# EAGLE design apo_board_2014 (EAGLE 6.5.0)
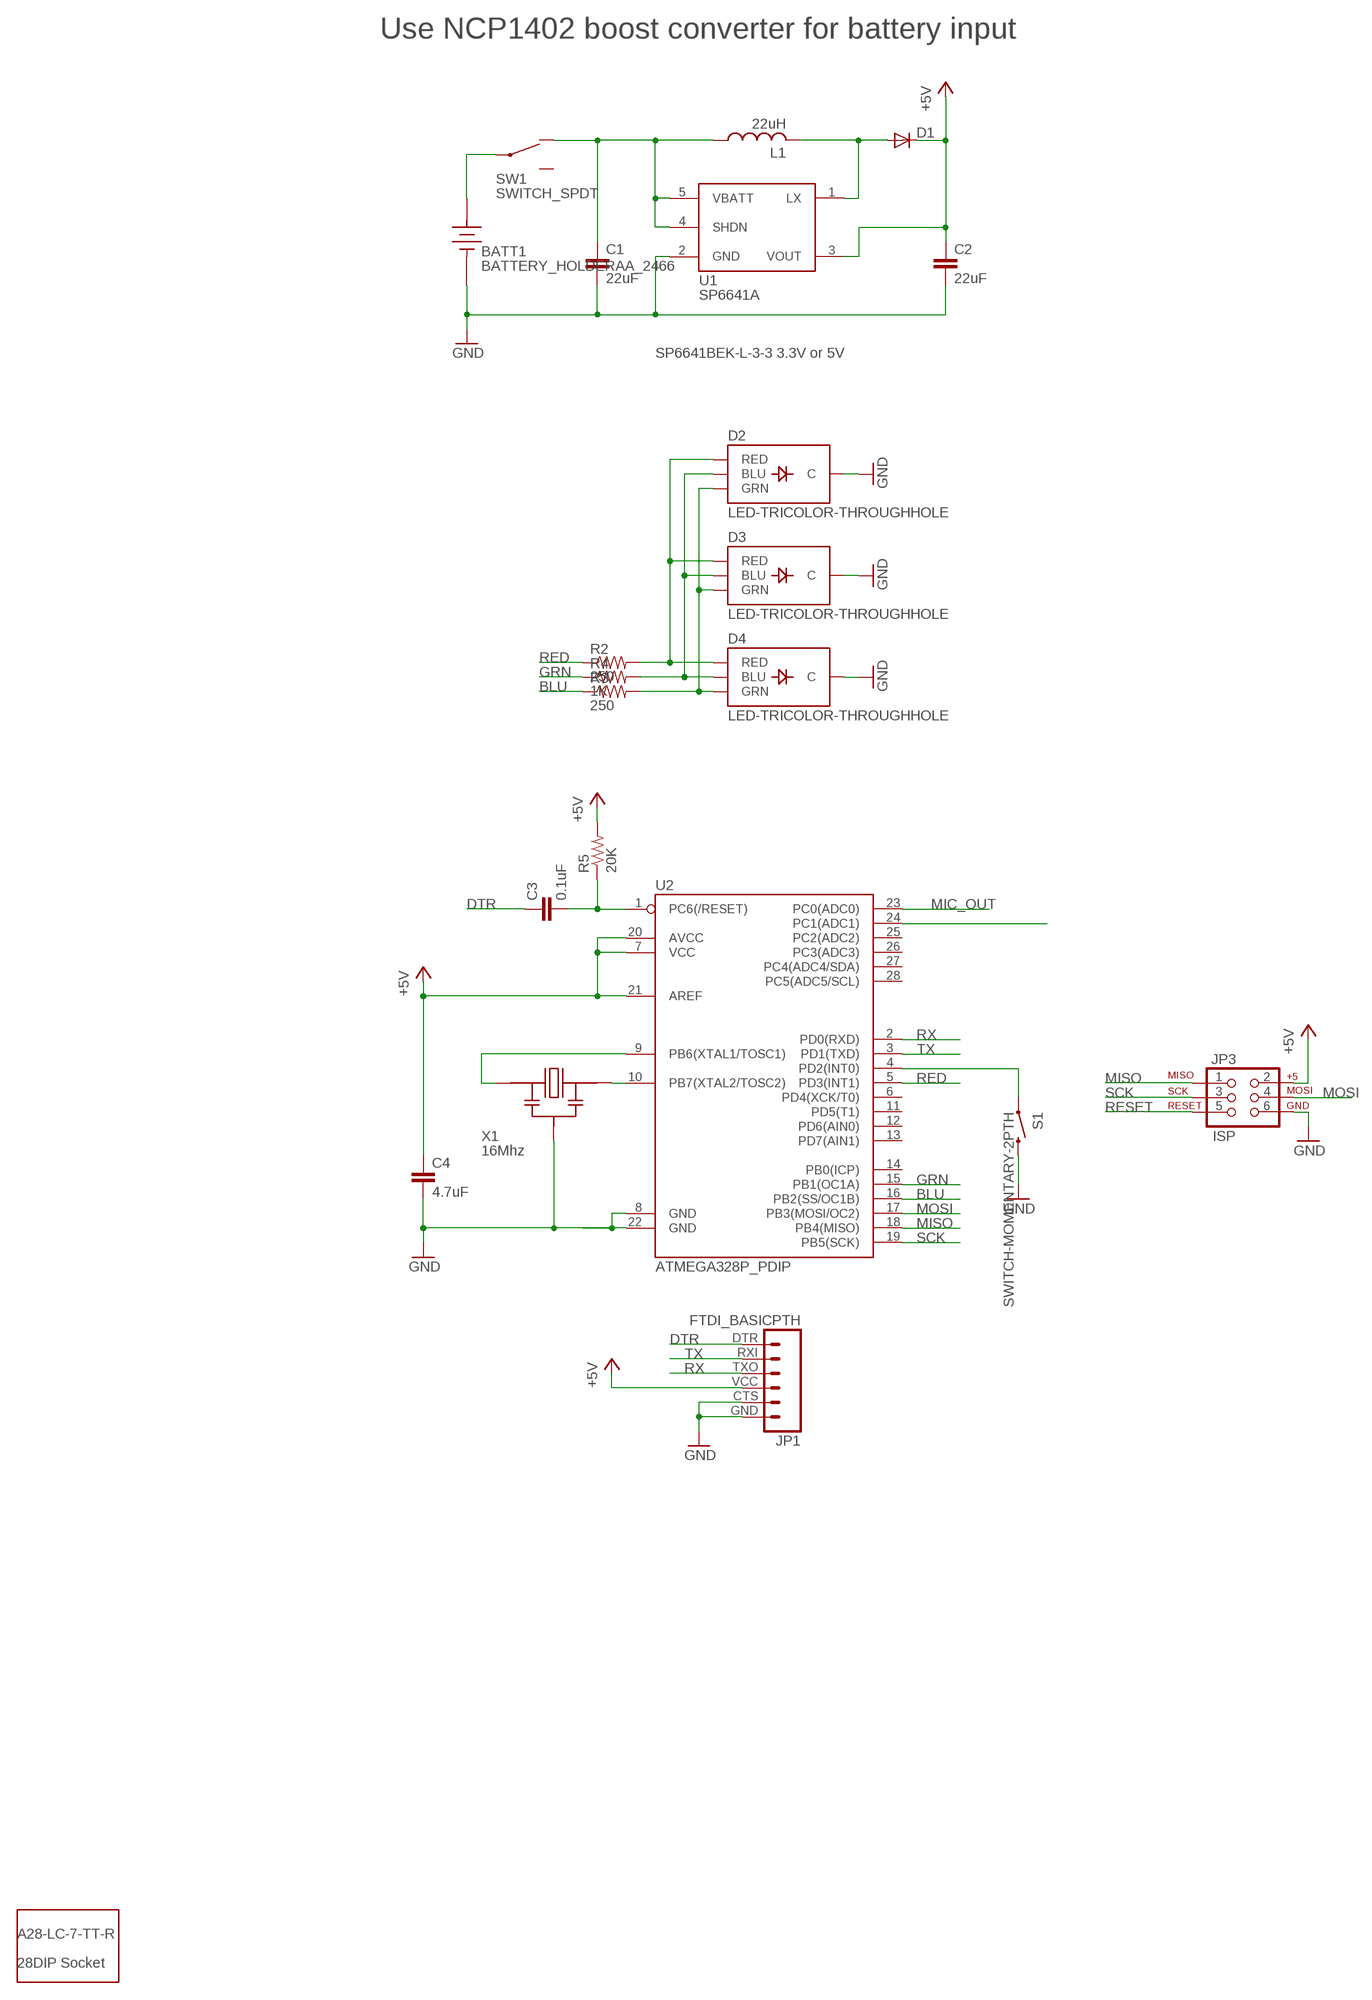
[diagram p0: schematic, sheet 1]

## Parts
BATT1  BATTERY_HOLDERAA_2466  [BATT_HOLDER_AA_2466]
C1  22uF  CAPKIT  [CAP-PTH-SMALL-KIT]
C2  22uF  CAPKIT  [CAP-PTH-SMALL-KIT]
C3  0.1uF  CAPKIT  [CAP-PTH-SMALL-KIT]
C4  4.7uF  CAPKIT  [CAP-PTH-SMALL-KIT]
D1  DIODEKIT  [DIODE-1N4148-KIT]
D2  LED-TRICOLOR-THROUGHHOLE  [LED-TRICOLOR-THROUGHHOLE]
D3  LED-TRICOLOR-THROUGHHOLE  [LED-TRICOLOR-THROUGHHOLE]
D4  LED-TRICOLOR-THROUGHHOLE  [LED-TRICOLOR-THROUGHHOLE]
JP1  FTDI_BASICPTH  [FTDI_BASIC]
JP3  ISP  AVR_SPI_PRG_6PTH  [2X3]
L1  22uH  INDUCTORAIUR-02H  [INDUCTOR_AIUR-02H]
R2  250  RESISTORKIT  [AXIAL-0.3-KIT]
R3  250  RESISTORKIT  [AXIAL-0.3-KIT]
R4  1K  RESISTORKIT  [AXIAL-0.3-KIT]
R5  20K  RESISTORKIT  [AXIAL-0.3-KIT]
S1  SWITCH-MOMENTARY-2PTH  [TACTILE-PTH]
SW1  SWITCH_SPDT  [SWITCH_SPDT_OS102011MA1QN1C]
U1  SP6641A  [SOT23-5]
U2  ATMEGA328P_PDIP  [DIL28-3]
X1  16Mhz  CERAMIC_RESONATOR  [CERAMIC_RESONATOR_ZTT]

## Nets
+5V: C2.1 C4.1 D1.C JP1.VCC JP3.2 R5.P$2 U1.3(VOUT) U2.7(VCC) U2.20(AVCC) U2.21(AREF)
BATT: BATT1.P SW1.P$2(COMMON)
BLU: R3.P$1 U2.16(PB2(SS/OC1B))
DTR: C3.1 JP1.DTR
GND: BATT1.N C1.2 C2.2 C4.2 D2.GND(C) D3.GND(C) D4.GND(C) JP1.CTS JP1.GND JP3.6 S1.3 U1.2(GND) U2.8(GND) U2.22(GND) X1.P$2
GRN: R4.P$1 U2.15(PB1(OC1A))
MIC_OUT: U2.23(PC0(ADC0))
MISO: JP3.1 U2.18(PB4(MISO))
MOSI: JP3.4 U2.17(PB3(MOSI/OC2))
N$1: U2.9(PB6(XTAL1/TOSC1)) X1.P$1
N$2: U2.10(PB7(XTAL2/TOSC2)) X1.P$3
N$3: S1.1 U2.4(PD2(INT0))
N$8: D2.GRN D3.GRN D4.GRN R3.P$2
N$9: D2.BLU D3.BLU D4.BLU R4.P$2
N$10: C3.2 R5.P$1 U2.1(PC6(/RESET))
N$12: U2.24(PC1(ADC1))
N$13: D2.RED D3.RED D4.RED R2.P$2
N$14: D1.A L1.P$2 U1.1(LX)
N$16: C1.1 L1.P$1 SW1.P$3 U1.4(SHDN) U1.5(VBATT)
RED: R2.P$1 U2.5(PD3(INT1))
RESET: JP3.5
RX: JP1.TXO U2.2(PD0(RXD))
SCK: JP3.3 U2.19(PB5(SCK))
TX: JP1.RXI U2.3(PD1(TXD))
Unconnected: SW1.P$1 U2.6(PD4(XCK/T0)) U2.11(PD5(T1)) U2.12(PD6(AIN0)) U2.13(PD7(AIN1)) U2.14(PB0(ICP)) U2.25(PC2(ADC2)) U2.26(PC3(ADC3)) U2.27(PC4(ADC4/SDA)) U2.28(PC5(ADC5/SCL))

## Notes on the sheet
- Use NCP1402 boost converter for battery input
- SP6641BEK-L-3-3 3.3V or 5V

## Library data of the parts
BATT1 = 1_BES_ELECTROMECHANICAL:BATTERY_HOLDER
C1-C4 = SparkFun-Passives:CAP: Capacitor Standard 0603 ceramic capacitor, and 0.1" leaded capacitor.
D1 = SparkFun-DiscreteSemi:DIODE: Diode These are standard reverse protection diodes and small signal diodes. SMA package can handle up to about 1A. SOD-323 can handle about 200mA. What the SOD-323 package when ordering, there are some mfgs out there that are 5-pin packages.
D2-D4 = SparkFun:LED-TRICOLOR-THROUGHHOLE
JP1 = SparkFun-Connectors:FTDI_BASIC: FTDI Basic header with labels
JP3 = SparkFun:AVR_SPI_PRG_6: AVR ISP 6 Pin This is the reduced ISP connector for AVR programming. Common on Arduino. This footprint will take up less PCB space and can be used with a 10-pin to 6-pin adapter such as SKU: BOB-08508
L1 = 1_Dan Master:INDUCTOR: SMT Inductor
R2-R5 = SparkFun-Passives:RESISTOR: Resistor Basic schematic elements and footprints for 0603, 1206, and PTH resistors.
S1 = SparkFun:SWITCH-MOMENTARY-2
SW1 = 1_Dan Master:SWITCH_SPDT
U1 = 1_Dan Master:SP6641A
U2 = SparkFun-DigitalIC:ATMEGA328P_PDIP: uC used in the Arduino 32kb flash, 1k EEPROM, 2k SRAM This is the through-hole version of this chip.
X1 = 1_Dan Master:CERAMIC_RESONATOR

## Net classes
0 default: width 0.203 mm
1 vcc: width 0.254 mm

## Board
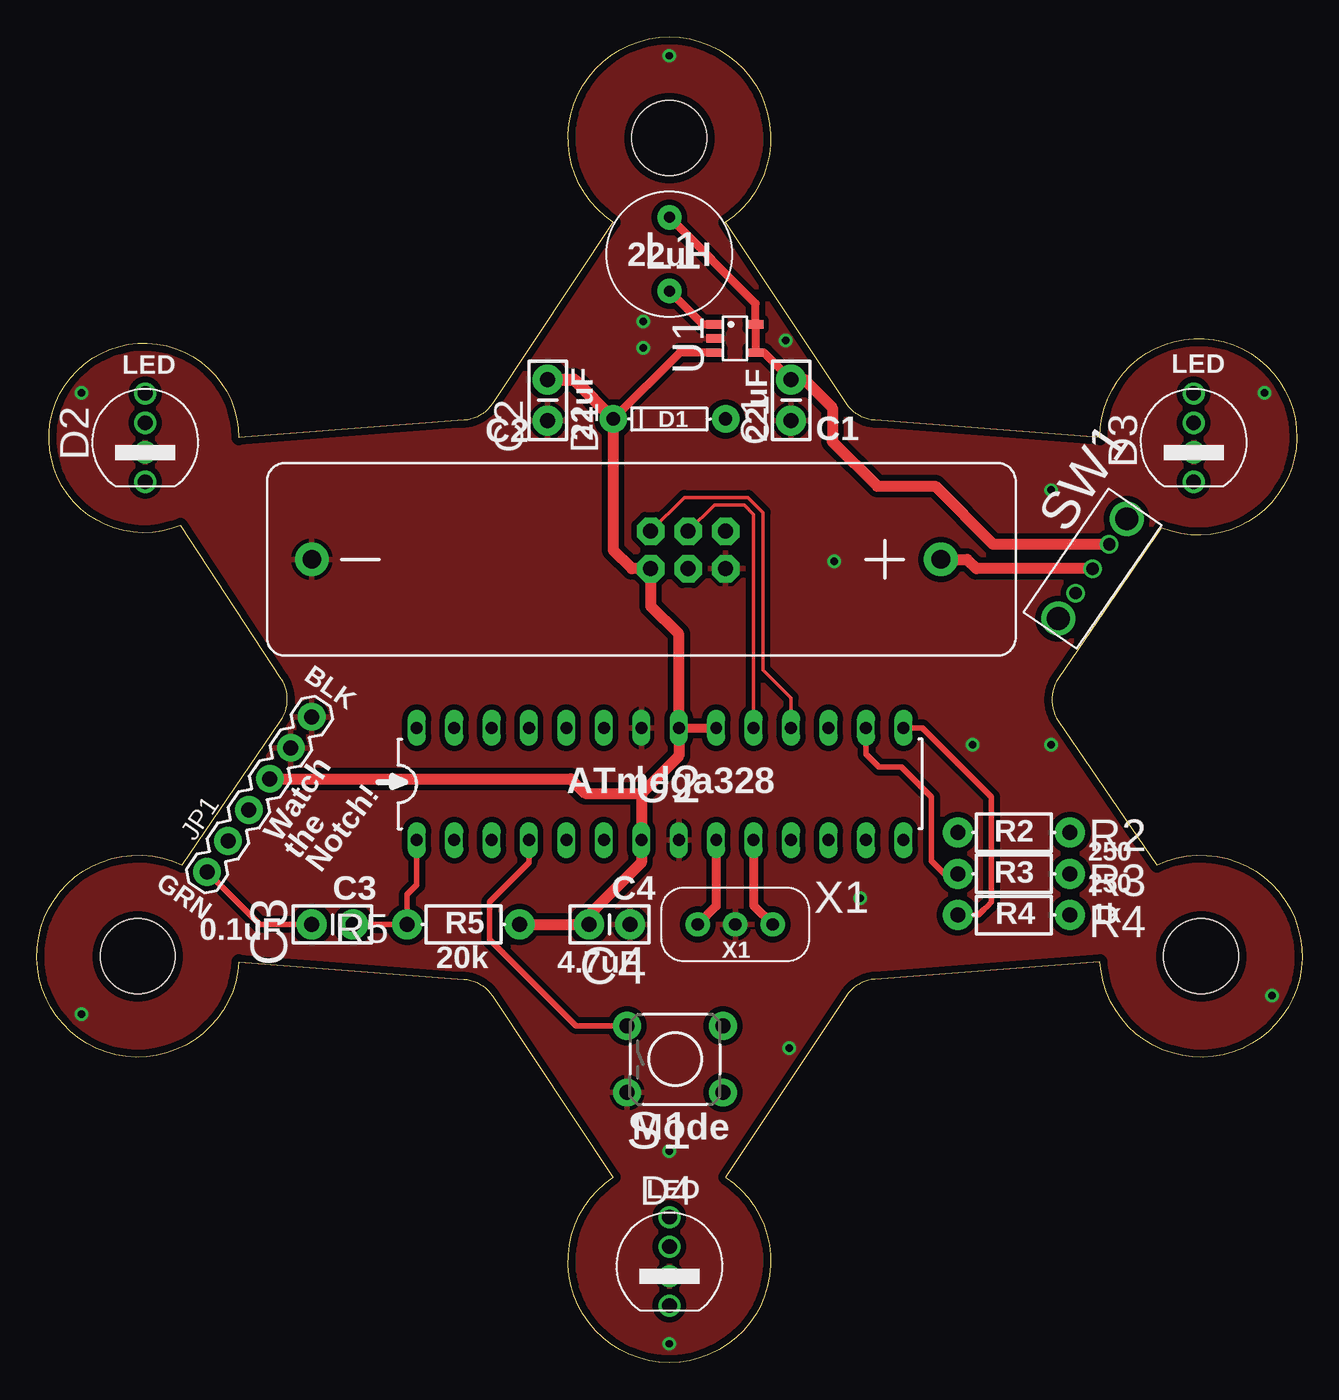
[diagram p1: board, top side]
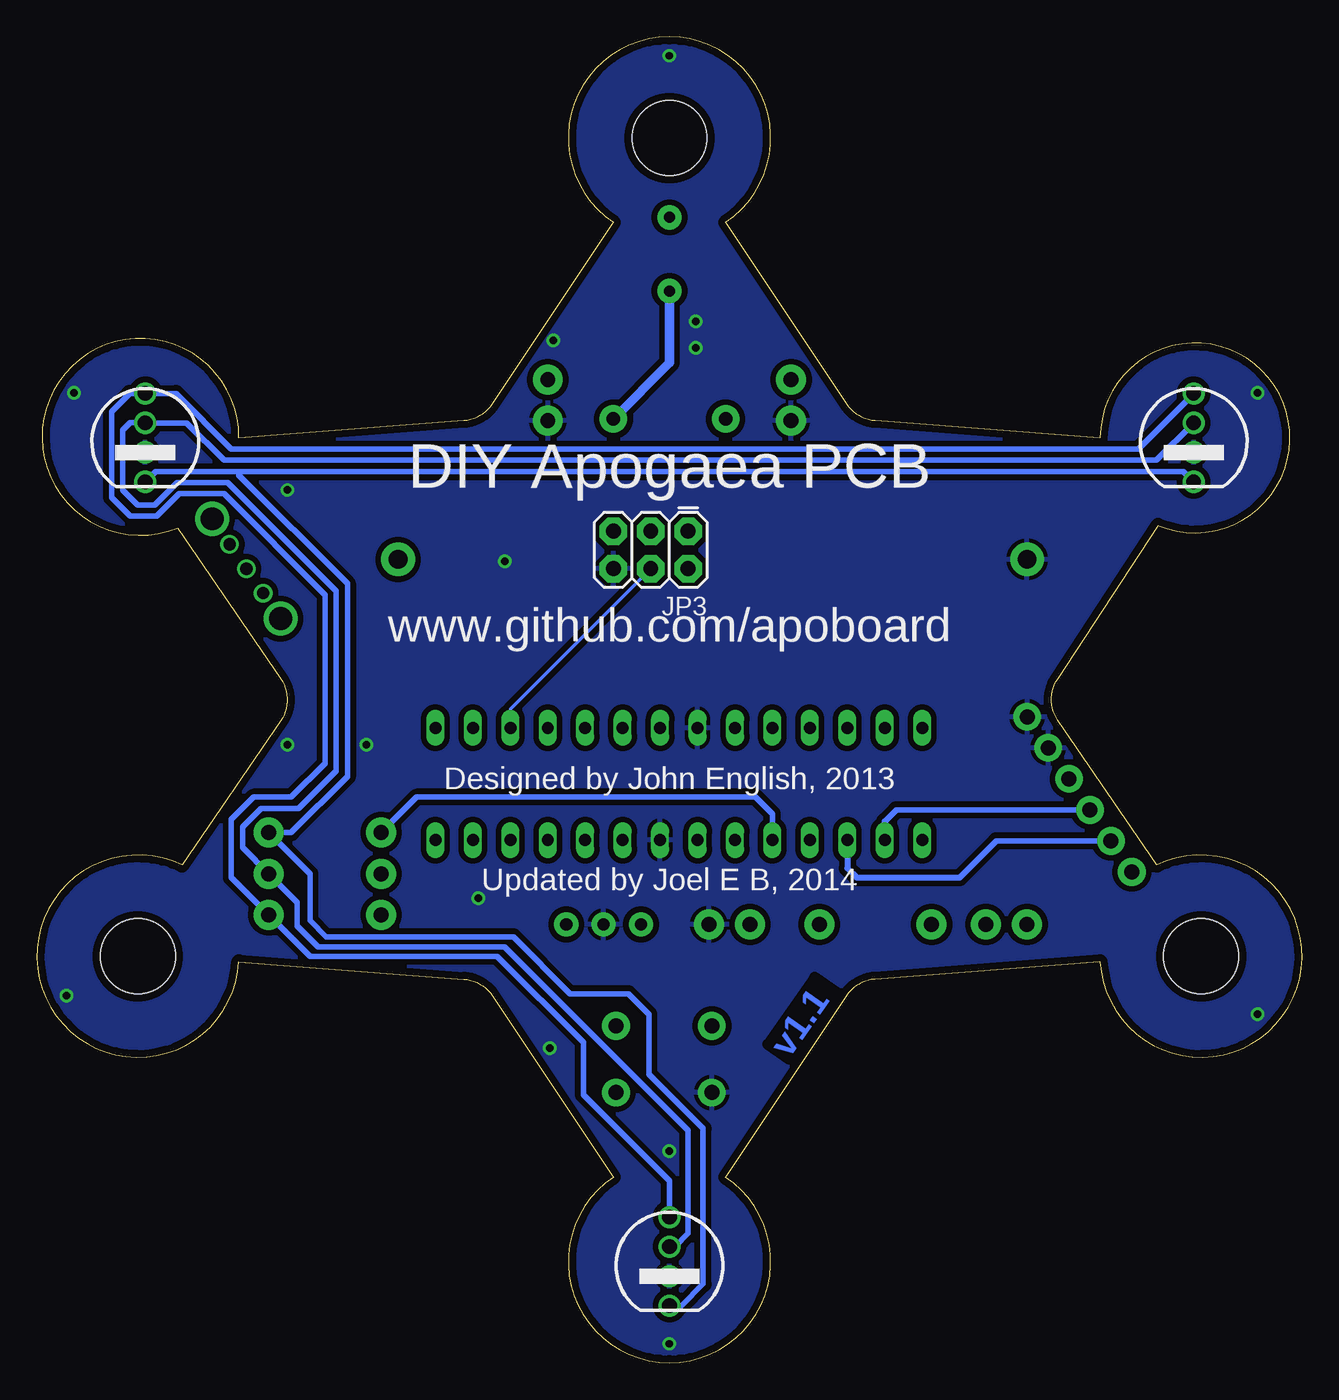
[diagram p2: board, bottom side, seen from below]

Size 85.83 x 89.94 mm. Coordinates in mm from the lower left corner, seen from the top.
Outline: 9.85,33.75 16.55,43.56 arc68 16.58,46.39 9.76,56.79 arc-293 13.7,62.75 28.98,63.92 arc52 30.9,65.05 39.1,77.35 arc-293 46.72,77.35 54.93,65.05 arc52 56.85,63.92 72.12,62.75 arc-293 76.29,56.62 69.29,46.4 arc69 69.29,43.53 75.98,33.75 arc-293 72.12,27.19 56.85,26.01 arc52 54.93,24.89 46.72,12.58 arc-293 39.1,12.58 30.9,24.89 arc52 28.98,26.01 13.7,27.19 arc-293 9.85,33.75
Copper layers (1+16): Top 0.0178mm / dielectric 12mil / Bottom 0.0178mm
Design rules "GoldPhoenix-BES-2Lyr *": minimum track width 6mil, minimum drill 8mil, track to track 6mil, track to pad 6mil, pad to pad 6mil, via to via 6mil, smd to smd 6mil, copper to edge 20mil, drill to drill 16mil, minimum pad ring 8mil, minimum via ring 8mil, stop-mask expansion 3mil, vias tented up to drill 21mil, thermal gap 10mil
Holes 5.08 mm at 6.84,27.57 78.98,27.57 42.91,83.07

### Footprints (pad centres in the part's own frame; a part is rotated, then mirrored left to right if it is on the bottom)
BATT_HOLDER_AA_2466 = drill 1.27 pad 2.286: N -22.352,0; P 20.32,0
CAP-PTH-SMALL-KIT = drill 1.016 pad 2.032: 1 -1.397,0; 2 1.397,0
DIODE-1N4148-KIT = drill 0.9 pad 1.88: A -3.81,0; C 3.81,0
LED-TRICOLOR-THROUGHHOLE = drill 1: BLU 3,0; GND -1,0; GRN 1,0; RED -3,0
FTDI_BASIC = drill 1.016 pad 1.88: CTS 10.16,0; DTR 0,0; GND 12.7,0; RXI 2.54,0; TXO 5.08,0; VCC 7.62,0
2X3 = drill 1.016 pad 1.88 octagon: 1 0,0; 2 0,2.54; 3 2.54,0; 4 2.54,2.54; 5 5.08,0; 6 5.08,2.54
INDUCTOR_AIUR-02H = drill 0.737 pad 1.651: P$1 0,2.502; P$2 0,-2.502
AXIAL-0.3-KIT = drill 1.016 pad 2.032: P$1 -3.81,0; P$2 3.81,0
TACTILE-PTH = drill 1.016 pad 1.88: 1 -3.251,2.261; 2 3.251,2.261; 3 -3.251,-2.261; 4 3.251,-2.261
SWITCH_SPDT_OS102011MA1QN1C = drill 0.838: P$1 2.007,0; P$2 0,0; P$3 -2.007,0 | drill 1.549: P$4 -4.102,0; P$5 4.102,0
SOT23-5 = smd 0.55 x 1.05: 1 -0.95,-1.4; 2 0,-1.4; 3 0.95,-1.4; 4 0.95,1.4; 5 -0.95,1.4
DIL28-3 = drill 0.813 long: 1 -16.51,-3.81; 2 -13.97,-3.81; 3 -11.43,-3.81; 4 -8.89,-3.81; 5 -6.35,-3.81; 6 -3.81,-3.81; 7 -1.27,-3.81; 8 1.27,-3.81; 9 3.81,-3.81; 10 6.35,-3.81; 11 8.89,-3.81; 12 11.43,-3.81; 13 13.97,-3.81; 14 16.51,-3.81; 15 16.51,3.81; 16 13.97,3.81; 17 11.43,3.81; 18 8.89,3.81; 19 6.35,3.81; 20 3.81,3.81; 21 1.27,3.81; 22 -1.27,3.81; 23 -3.81,3.81; 24 -6.35,3.81; 25 -8.89,3.81; 26 -11.43,3.81; 27 -13.97,3.81; 28 -16.51,3.81
CERAMIC_RESONATOR_ZTT = drill 0.838 pad 1.651: P$1 -2.54,0; P$2 0,0; P$3 2.54,0

### Placement (x,y rotation side)
BATT1  41.01,54.49 0 top
C1  51.17,65.29 270 top
C2  34.66,65.29 270 top
C3  20.05,29.73 0 top
C4  38.85,29.73 0 top
D1  42.91,64.02 180 top
D2  7.35,62.75 90 top
D3  78.47,62.75 90 top
D4  42.91,6.87 90 top
JP1  11.54,33.28 56 top
JP3  41.64,56.4 180 bottom
L1  42.91,75.19 0 top
R2  66.28,35.95 0 top
R3  66.28,33.16 0 top
R4  66.28,30.36 0 top
R5  28.94,29.73 0 top
S1  43.29,20.58 0 top
SW1  71.61,53.86 235.5 top
U1  47.36,69.48 270 top
U2  42.28,39.25 0 top
X1  47.38,29.73 0 top

### Tracks (layer width: path | path; a pad name or v marks a point on that pad's centre or on a via)
+5V
  Top 0.559: U1.3 43.61,68.53 D1.C
  Top 0.61: U2.21 U2.20
  Top 0.762: 41.01,38.62 43.55,41.16 U2.21 43.55,49.41 41.64,51.32 JP3.2 40.37,53.86 39.1,55.13 D1.C | 41.01,38.62 U2.7 41.01,33.92 37.45,30.36 C4.1 R5.P$2 | 41.01,38.62 37.2,38.62 36.21,39.6 JP1.VCC
  Top 0.813: C2.1 36.44,66.69 D1.C
BATT
  Top 0.762: BATT1.P 63.11,54.49 63.74,53.86 SW1.P$2
BLU
  Top 0.381: U2.16 56.25,41.29 57.14,40.4 58.66,40.4 60.69,38.36 60.69,34.05 61.58,33.16 R3.P$1
DTR
  Top 0.381: C3.1 15.1,29.73 JP1.DTR
GND  (via drill 0.51)
  other vias: 50.79,69.35 42.91,14.36 42.91,88.66 68.82,59.19 68.82,41.92 51.04,21.35 55.87,31.51 42.91,1.28 41.13,68.84 41.13,70.62 83.3,65.8 3.03,65.8 3.03,23.63 83.81,24.9 63.49,41.92 54.09,54.37
  pour Top (isolate 0.381, rank 6): 93.71,95.77 -7.89,95.77 -7.89,-5.83 93.71,-5.83
  pour Bottom (isolate 0.381, rank 6): 93.71,95.77 -7.89,95.77 -7.89,-5.83 93.71,-5.83
GRN
  Top 0.381: U2.15 60.06,43.06 64.76,38.36 64.76,31.25 64.5,31 64.25,30.74 63.87,30.36 R4.P$1
MISO
  Top 0.254: U2.18 51.17,45.1 49.26,47 49.26,57.67 48.25,58.68 43.93,58.68 JP3.1
MOSI
  Bottom 0.254: U2.17 53.71,44.33 JP3.4
N$1
  Top 0.61: U2.9 46.09,30.97 X1.P$1
N$2
  Top 0.61: U2.10 48.63,31.02 X1.P$3
N$3
  Top 0.381: U2.4 33.39,33.92 30.72,31.25 30.72,28.71 36.59,22.85 S1.1
N$8
  Bottom 0.381: D4.GRN 42.55,7.87 41.64,8.77 41.64,15.76 54.09,28.2 66.74,28.2 68.16,29.63 68.16,31.23 R3.P$2 71.87,34.94 71.87,36.33 70.6,37.6 68.06,37.6 65.52,40.14 65.52,52.33 72.88,59.7 76.31,59.7 77.84,58.18 78.98,58.18 80,59.19 80,63.26 79.49,63.76 78.49,63.76 D3.GRN 75.66,63.75 73.14,61.22 9.88,61.22 D2.GRN
N$9
  Bottom 0.381: D4.BLU 42.91,12.33 48.75,18.17 48.75,21.73 54.6,27.57 67.3,27.57 R4.P$2 72.63,32.9 72.63,36.84 71.11,38.36 68.57,38.36 66.28,40.65 66.28,52.08 73.14,58.94 76.19,58.94 77.71,57.41 79.49,57.41 80.76,58.68 80.76,64.53 79.54,65.75 D3.BLU 76.39,65.75 72.63,61.99 11.11,61.99 D2.BLU
N$10
  Top 0.381: C3.2 R5.P$1 25.13,31.76 25.77,32.4 U2.1
N$13
  Bottom 0.381: D4.RED 42.1,3.87 40.63,5.34 40.63,15.89 44.31,19.57 44.31,23.63 45.71,25.03 49.64,25.03 53.5,28.89 66.2,28.89 67.3,29.98 67.3,33.16 R2.P$2 68.57,35.95 64.76,39.76 64.76,52.84 72.12,60.21 72.12,60.46 | D3.RED 77.76,60.46 72.12,60.46 | 72.12,60.46 8.07,60.46 D2.RED
N$14
  Top 0.559: U1.1 45.18,70.43 L1.P$2
  Bottom 0.635: D1.A 42.91,67.83 L1.P$2
N$16
  Top 0.559: L1.P$1 48.76,71.85 U1.5 U1.4 49.32,68.53 C1.1
  Top 0.762: C1.1 52.06,66.69 53.96,64.78 53.96,62.49 57.01,59.45 60.95,59.45 64.88,55.51 SW1.P$3
RED
  Bottom 0.381: U2.5 35.93,37.22 37.07,38.36 60.06,38.36 R2.P$1
RX
  Bottom 0.381: JP1.TXO 27.52,37.5 28.31,36.71
  Bottom 0.406: U2.2 28.31,36.71
SCK
  Top 0.254: U2.19 48.63,57.54 47.99,58.18 45.96,58.18 JP3.3
TX
  Bottom 0.381: JP1.RXI 20.74,35.39 23.23,32.9
  Bottom 0.406: U2.3 30.85,33.54 30.21,32.9 23.23,32.9

### Text on the board
Bottom: v1.1
tPlace: 22uH | LED | LED | 22uF | D1 | 22uF | C1 | C2 | BLK | ATmega328 | Watch | R2 | the | 250 | Notch! | R3 | GRN | 250 | C3 | C4 | R4 | 1k | 0.1uF | R5 | 20k | X1 | 4.7uF | Mode | LED
bPlace: DIY Apogaea PCB | www.github.com/apoboard | Designed by John English, 2013 | Updated by Joel E B, 2014